# EAGLE schematic frets (EAGLE 8.3.1)
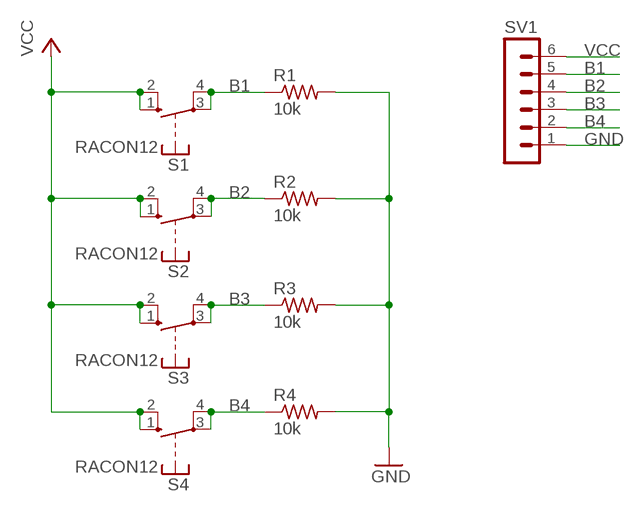
[diagram p0: schematic, sheet 1]

## Parts
R1  10k  R-US_0207/7  [0207/7]
R2  10k  R-US_0207/7  [0207/7]
R3  10k  R-US_0207/7  [0207/7]
R4  10k  R-US_0207/7  [0207/7]
S1  RACON12  [RACON12]
S2  RACON12  [RACON12]
S3  RACON12  [RACON12]
S4  RACON12  [RACON12]
SV1  MA06-1  [MA06-1]

## Nets
B1: R1.1 S1.3(P) S1.4(P) SV1.5
B2: R2.1 S2.3(P) S2.4(P) SV1.4
B3: R3.1 S3.3(P) S3.4(P) SV1.3
B4: R4.1 S4.3(P) S4.4(P) SV1.2
GND: R1.2 R2.2 R3.2 R4.2 SV1.1
VCC: S1.1(S) S1.2(S) S2.1(S) S2.2(S) S3.1(S) S3.2(S) S4.1(S) S4.2(S) SV1.6

## Library data of the parts
R1-R4 = rcl:R-US_: RESISTOR, American symbol
S1-S4 = switch-misc:RACON12: ITT SWITCH
SV1 = con-lstb:MA06-1: PIN HEADER; OC_FARNELL: unknown; OC_NEWARK: unknown